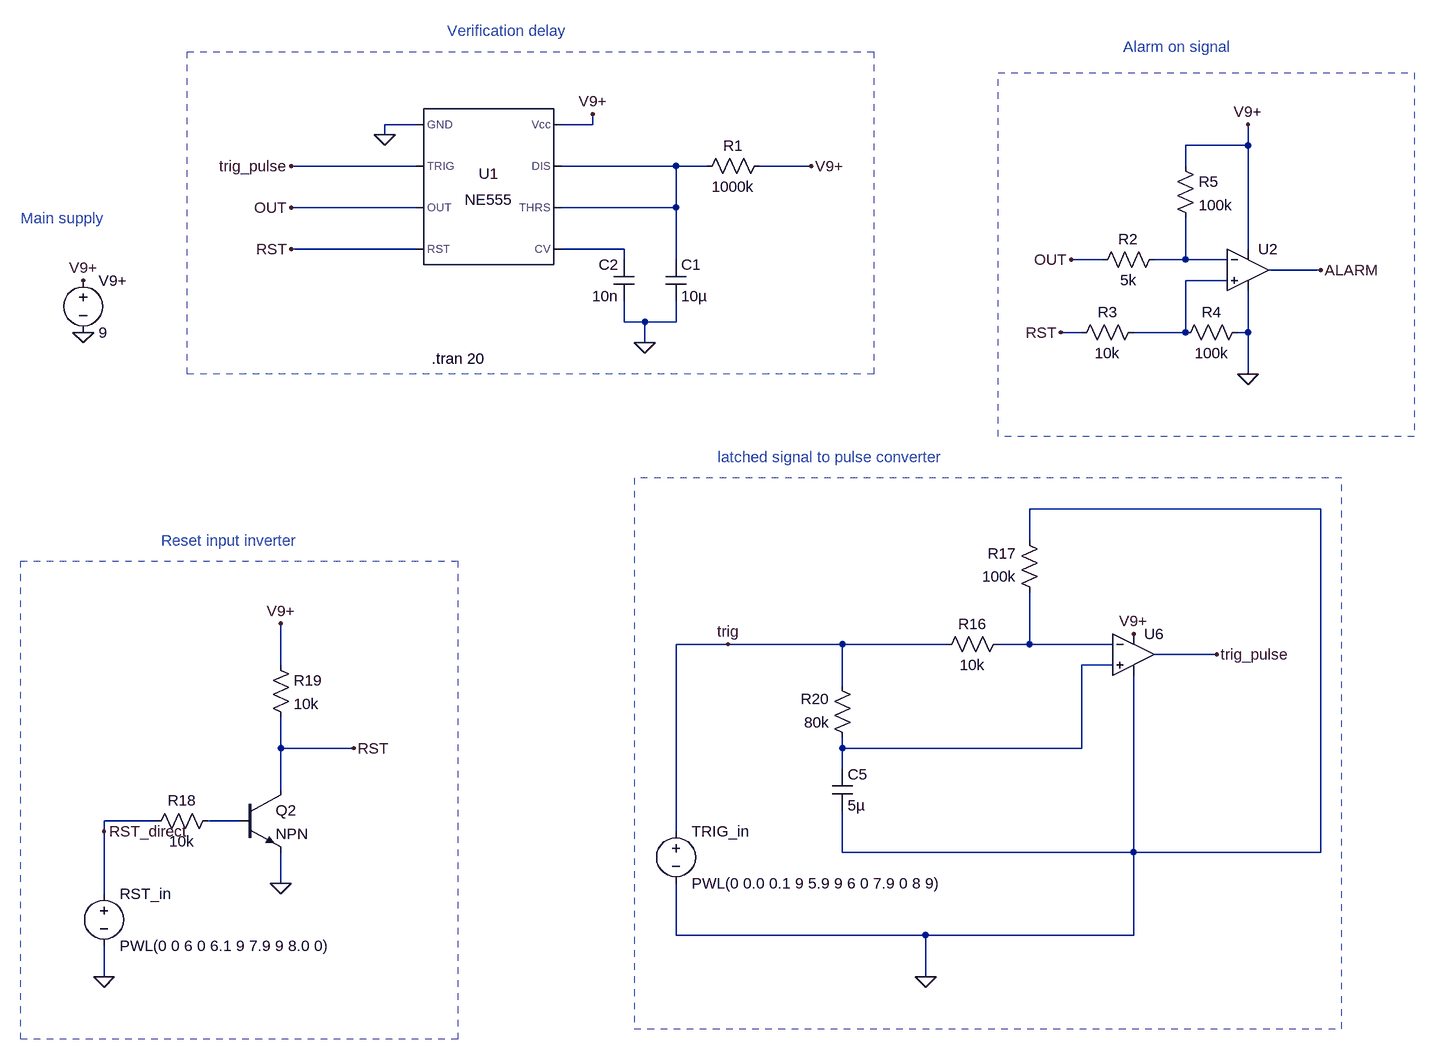
[diagram p0: schematic 5.timming.asc]
5.timming.asc, the LTspice schematic file:
Version 4.1
SHEET 1 3316 1700
WIRE -768 112 -816 112
WIRE -496 112 -496 96
WIRE -496 112 -544 112
WIRE -816 128 -816 112
WIRE 512 144 512 112
WIRE 512 144 416 144
WIRE -768 176 -960 176
WIRE -368 176 -544 176
WIRE -320 176 -368 176
WIRE -160 176 -240 176
WIRE 416 176 416 144
WIRE -768 240 -960 240
WIRE -368 240 -368 176
WIRE -368 240 -544 240
WIRE -768 304 -960 304
WIRE -448 304 -544 304
WIRE 512 304 512 144
WIRE -448 320 -448 304
WIRE -368 320 -368 240
WIRE 288 320 240 320
WIRE 416 320 416 256
WIRE 416 320 368 320
WIRE 480 320 416 320
WIRE 624 336 544 336
WIRE 480 352 416 352
WIRE -448 416 -448 384
WIRE -416 416 -448 416
WIRE -368 416 -368 384
WIRE -368 416 -416 416
WIRE 256 432 224 432
WIRE 416 432 416 352
WIRE 416 432 336 432
WIRE 512 432 512 368
WIRE 512 432 496 432
WIRE -416 448 -416 416
WIRE 512 496 512 432
WIRE 624 704 176 704
WIRE 176 752 176 704
WIRE -288 912 -368 912
WIRE -112 912 -288 912
WIRE 48 912 -112 912
WIRE 176 912 176 832
WIRE 176 912 128 912
WIRE 304 912 176 912
WIRE 464 928 368 928
WIRE -976 944 -976 880
WIRE 304 944 256 944
WIRE -112 976 -112 912
WIRE -976 1072 -976 1024
WIRE -864 1072 -976 1072
WIRE -112 1072 -112 1056
WIRE 256 1072 256 944
WIRE 256 1072 -112 1072
WIRE -112 1104 -112 1072
WIRE -976 1136 -976 1072
WIRE -1168 1184 -1248 1184
WIRE -1040 1184 -1088 1184
WIRE -1248 1200 -1248 1184
WIRE -368 1200 -368 912
WIRE -112 1232 -112 1168
WIRE 336 1232 336 960
WIRE 336 1232 -112 1232
WIRE 624 1232 624 704
WIRE 624 1232 336 1232
WIRE -976 1280 -976 1232
WIRE -1248 1296 -1248 1200
WIRE -368 1360 -368 1280
WIRE 16 1360 -368 1360
WIRE 336 1360 336 1232
WIRE 336 1360 16 1360
WIRE -1248 1424 -1248 1376
WIRE 16 1424 16 1360
FLAG -416 448 0
FLAG -816 128 0
FLAG -160 176 V9+
FLAG -1248 1200 RST_direct
FLAG -1280 432 0
FLAG -1280 352 V9+
FLAG -496 96 V9+
FLAG -960 240 OUT
FLAG 336 896 V9+
FLAG -288 912 trig
FLAG 16 1424 0
FLAG -976 880 V9+
FLAG 464 928 trig_pulse
FLAG -960 176 trig_pulse
FLAG -960 304 RST
FLAG -1248 1424 0
FLAG -976 1280 0
FLAG -864 1072 RST
FLAG 240 320 OUT
FLAG 224 432 RST
FLAG 512 496 0
FLAG 512 112 V9+
FLAG 624 336 ALARM
SYMBOL Misc\\NE555 -656 208 R0
SYMATTR InstName U1
SYMBOL res -224 160 R90
WINDOW 0 0 56 VBottom 2
WINDOW 3 32 56 VTop 2
SYMATTR InstName R1
SYMATTR Value 1000k
SYMBOL cap -384 320 R0
SYMATTR InstName C1
SYMATTR Value 10µ
SYMBOL voltage -1280 336 R0
WINDOW 123 0 0 Left 0
WINDOW 39 0 0 Left 0
SYMATTR InstName V9+
SYMATTR Value 9
SYMBOL cap -432 384 R180
WINDOW 0 24 56 Left 2
WINDOW 3 24 8 Left 2
SYMATTR InstName C2
SYMATTR Value 10n
SYMBOL voltage -368 1184 R0
WINDOW 123 0 0 Left 0
WINDOW 39 0 0 Left 0
SYMATTR InstName TRIG_in
SYMATTR Value PWL(0 0.0 0.1 9 5.9 9 6 0 7.9 0 8 9)
SYMBOL OpAmps\\UniversalOpAmp2 336 928 R0
SYMATTR InstName U6
SYMATTR Value2 Avol=140k GBW=1.2Meg Slew=0.5Meg
SYMATTR SpiceLine Ilimit=40m Rail=0 Vos=2.5m
SYMATTR SpiceLine2 En=0 Enk=0 In=0 Ink=0 Rin=10Meg
SYMBOL res 144 896 R90
WINDOW 0 0 56 VBottom 2
WINDOW 3 32 56 VTop 2
SYMATTR InstName R16
SYMATTR Value 10k
SYMBOL res 192 848 R180
WINDOW 0 36 76 Left 2
WINDOW 3 36 40 Left 2
SYMATTR InstName R17
SYMATTR Value 100k
SYMBOL npn -1040 1136 R0
SYMATTR InstName Q2
SYMBOL res -1072 1168 R90
WINDOW 0 0 56 VBottom 2
WINDOW 3 32 56 VTop 2
SYMATTR InstName R18
SYMATTR Value 10k
SYMBOL res -992 928 R0
SYMATTR InstName R19
SYMATTR Value 10k
SYMBOL res -96 1072 R180
WINDOW 0 36 76 Left 2
WINDOW 3 36 40 Left 2
SYMATTR InstName R20
SYMATTR Value 80k
SYMBOL cap -128 1104 R0
SYMATTR InstName C5
SYMATTR Value 5µ
SYMBOL voltage -1248 1280 R0
WINDOW 123 0 0 Left 0
WINDOW 39 0 0 Left 0
SYMATTR InstName RST_in
SYMATTR Value PWL(0 0 6 0 6.1 9 7.9 9 8.0 0)
SYMBOL OpAmps\\UniversalOpAmp2 512 336 R0
SYMATTR InstName U2
SYMATTR Value2 Avol=140k GBW=1.2Meg Slew=0.5Meg
SYMATTR SpiceLine Ilimit=40m Rail=0 Vos=2.5m
SYMATTR SpiceLine2 En=0 Enk=0 In=0 Ink=0 Rin=10Meg
SYMBOL res 384 304 R90
WINDOW 0 0 56 VBottom 2
WINDOW 3 32 56 VTop 2
SYMATTR InstName R2
SYMATTR Value 5k
SYMBOL res 352 416 R90
WINDOW 0 0 56 VBottom 2
WINDOW 3 32 56 VTop 2
SYMATTR InstName R3
SYMATTR Value 10k
SYMBOL res 512 416 R90
WINDOW 0 0 56 VBottom 2
WINDOW 3 32 56 VTop 2
SYMATTR InstName R4
SYMATTR Value 100k
SYMBOL res 400 160 R0
SYMATTR InstName R5
SYMATTR Value 100k
TEXT -744 472 Left 2 !.tran 20
TEXT -720 -32 Left 2 ;Verification delay
TEXT 320 -8 Left 2 ;Alarm on signal
TEXT -1160 752 Left 2 ;Reset input inverter
TEXT -304 624 Left 2 ;latched signal to pulse converter
TEXT -1376 256 Left 2 ;Main supply
RECTANGLE Normal -704 1520 -1376 784 2
RECTANGLE Normal -432 1504 656 656 2
RECTANGLE Normal 128 32 768 592 2
RECTANGLE Normal -1120 0 -64 496 2

The netlist it stands for:
* 5.timming.asc
X§U1 0 trig_pulse OUT RST N002 N001 N001 V9+ NE555  ; pins GND TRIG OUT RST CV THRS DIS Vcc
R1 V9+ N001 1000k
C1 N001 0 10µ
V9+ V9+ 0 9
C2 0 N002 10n
V§TRIG_in trig 0 PWL(0 0.0 0.1 9 5.9 9 6 0 7.9 0 8 9)
X§U6 N006 N005 V9+ 0 trig_pulse level2 Avol=140k GBW=1.2Meg Slew=0.5Meg Ilimit=40m Rail=0 Vos=2.5m En=0 Enk=0 In=0 Ink=0 Rin=10Meg  ; pins In+ In- V+ V- OUT
R16 N005 trig 10k
R17 N005 0 100k
Q2 RST N007 0 0 NPN
R18 N007 RST_direct 10k
R19 V9+ RST 10k
R20 N006 trig 80k
C5 N006 0 5µ
V§RST_in RST_direct 0 PWL(0 0 6 0 6.1 9 7.9 9 8.0 0)
X§U2 N004 N003 V9+ 0 ALARM level2 Avol=140k GBW=1.2Meg Slew=0.5Meg Ilimit=40m Rail=0 Vos=2.5m En=0 Enk=0 In=0 Ink=0 Rin=10Meg  ; pins In+ In- V+ V- OUT
R2 N003 OUT 5k
R3 N004 RST 10k
R4 0 N004 100k
R5 V9+ N003 100k
.model NPN NPN
.model PNP PNP
.lib standard.bjt
.tran 20
* Verification delay
* Alarm on signal
* Reset input inverter
* latched signal to pulse converter
* Main supply
.lib NE555.sub
.lib UniversalOpAmp2.lib
.backanno
.end